# Altium schematic sheet system_electric_diagram.SchDoc
size A4
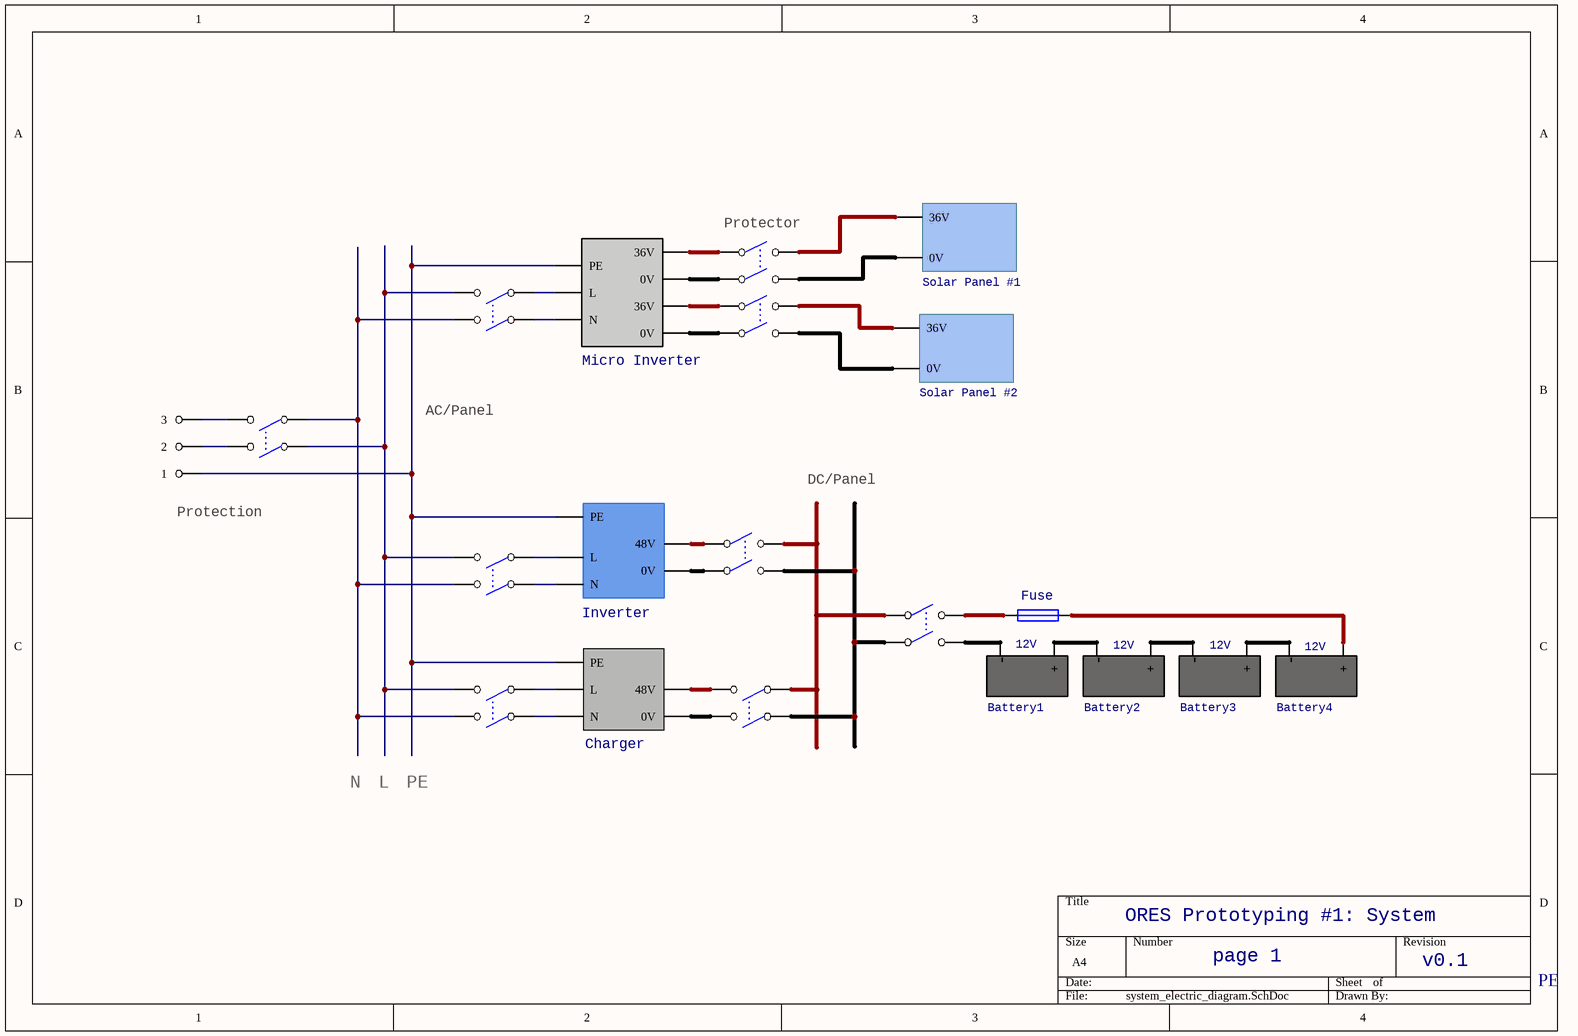
[diagram p0: system_electric_diagram.SchDoc]

## Parts
(Parts that share a designator on the sheet are numbered #1, #2 ... from top to bottom, then left to right.)
Battery1  12V
Battery2  12V
Battery3  12V
Battery4  12V
F1  Fuse  [FUSE1]
JP?  3 HEADER  (value not drawn)
K1  Switch  (value not drawn)
K?#1  Switch  (value not drawn)
K?#2  Switch  (value not drawn)
K?#3  Switch  (value not drawn)
K?#4  Switch  (value not drawn)
K?#5  Switch  (value not drawn)
K?#6  Switch  (value not drawn)
K?#7  Switch  (value not drawn)
K?#8  Switch  (value not drawn)
U?#1  Solar Panel #1
U?#2  Micro Inverter
U?#3  Solar Panel #2
U?#4  Inverter
U?#5  Charger

## Nets
NetBattery1_1: Battery1.1(-) K?#6.4
NetBattery1_2: Battery1.2(+) Battery2.1(-)
NetBattery2_2: Battery2.2(+) Battery3.1(-)
NetBattery3_2: Battery3.2(+) Battery4.1(-)
NetBattery4_2: Battery4.2(+) F1.2
NetJP?_1: JP?.1 U?#2.3(PE) U?#4.3(PE) U?#5.3(PE)
NetJP?_2: JP?.2 K1.2
NetJP?_3: JP?.3 K1.4
NetK1_1: K1.1 K?#3.4 K?#5.4 K?#7.4
NetK1_3: K1.3 K?#3.2 K?#5.2 K?#7.2
NetK?#1_1: K?#1.1 U?#2.7(36V)
NetK?#1_2: K?#1.2 U?#1.2(36V)
NetK?#1_3: K?#1.3 U?#2.6(0V)
NetK?#1_4: K?#1.4 U?#1.1(0V)
NetK?#2_1: K?#2.1 U?#2.5(36V)
NetK?#2_2: K?#2.2 U?#3.2(36V)
NetK?#2_3: K?#2.3 U?#2.4(0V)
NetK?#2_4: K?#2.4 U?#3.1(0V)
NetK?#3_1: K?#3.1 U?#2.1(N)
NetK?#3_3: K?#3.3 U?#2.2(L)
NetK?#4_1: K?#4.1 U?#4.5(48V)
NetK?#4_2: K?#4.2 K?#6.1 K?#8.3
NetK?#4_3: K?#4.3 U?#4.4(0V)
NetK?#4_4: K?#4.4 K?#6.3 K?#8.1
NetK?#5_1: K?#5.1 U?#4.1(N)
NetK?#5_3: K?#5.3 U?#4.2(L)
NetK?#7_1: K?#7.1 U?#5.1(N)
NetK?#7_3: K?#7.3 U?#5.2(L)
NetK?#8_2: K?#8.2 U?#5.4(0V)
NetK?#8_4: K?#8.4 U?#5.5(48V)

Not connected (* = marked no-connect by the designer): F1 1; K?#6 2

## Notes on the sheet
- (near K?#1) Protector
- AC/Panel
- (near JP?) Protection
- DC/Panel
- N
- L
- PE
- ORES Prototyping #1: System
- page 1
- v0.1

## Library data of the parts
Battery1-Battery4 = 1_BAT_12V
JP? = 3 HEADER: 3 Pin Header
K1 K?#1-K?#8 = SW-DPST
U?#1 U?#3 = 10_Solar_Panel_36V
U?#2 = 11_Micro_Inverter_2
U?#4 = 4_Inverter
U?#5 = 5_Charger_48V